# EAGLE design LED (EAGLE 9.6.2)
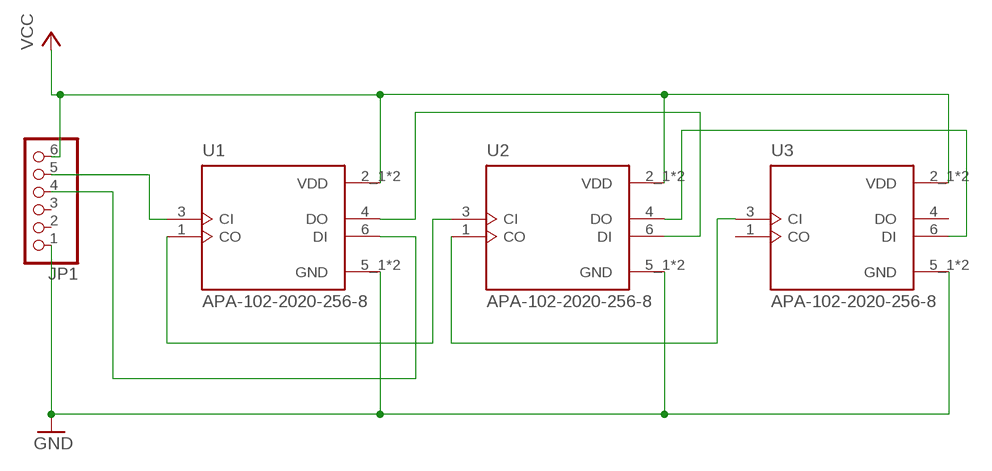
[diagram p0: schematic, sheet 1]

## Parts
JP1  PINHD-1X6CLEAN  [1X06-CLEAN]
U1  APA-102-2020-256-8  [LED_APA-102-2020-256-8]
U2  APA-102-2020-256-8  [LED_APA-102-2020-256-8]
U3  APA-102-2020-256-8  [LED_APA-102-2020-256-8]

## Nets
GND: JP1.1 U1.5_1(GND) U1.5_2(GND) U2.5_1(GND) U2.5_2(GND) U3.5_1(GND) U3.5_2(GND)
N$1: JP1.5 U1.3(CI)
N$2: JP1.4 U1.6(DI)
N$3: U1.1(CO) U2.3(CI)
N$4: U1.4(DO) U2.6(DI)
N$5: U2.4(DO) U3.6(DI)
N$6: U2.1(CO) U3.3(CI)
VCC: JP1.6 U1.2_1(VDD) U1.2_2(VDD) U2.2_1(VDD) U2.2_2(VDD) U3.2_1(VDD) U3.2_2(VDD)
Unconnected: JP1.2 JP1.3 U3.1(CO) U3.4(DO)

## Library data of the parts
JP1 = adafruit:PINHD-1X6: PIN HEADER
U1-U3 = APA-102-2020-256-8:APA-102-2020-256-8: 8-pin type LED three-color RGB Dimming control Check availability <https://pricing.snapeda.com/parts/APA-102-2020-256-8/iPixel%20LED%20Light%20Co./view-part?ref=eda>; AVAILABILITY: Not in stock; DESCRIPTION: 8-pin type LED three-color RGB Dimming control; MF: iPixel LED Light Co.; MP: APA-102-2020-256-8; PACKAGE: SMD-8 iPixel LED Light Co.; PRICE: None

## Board
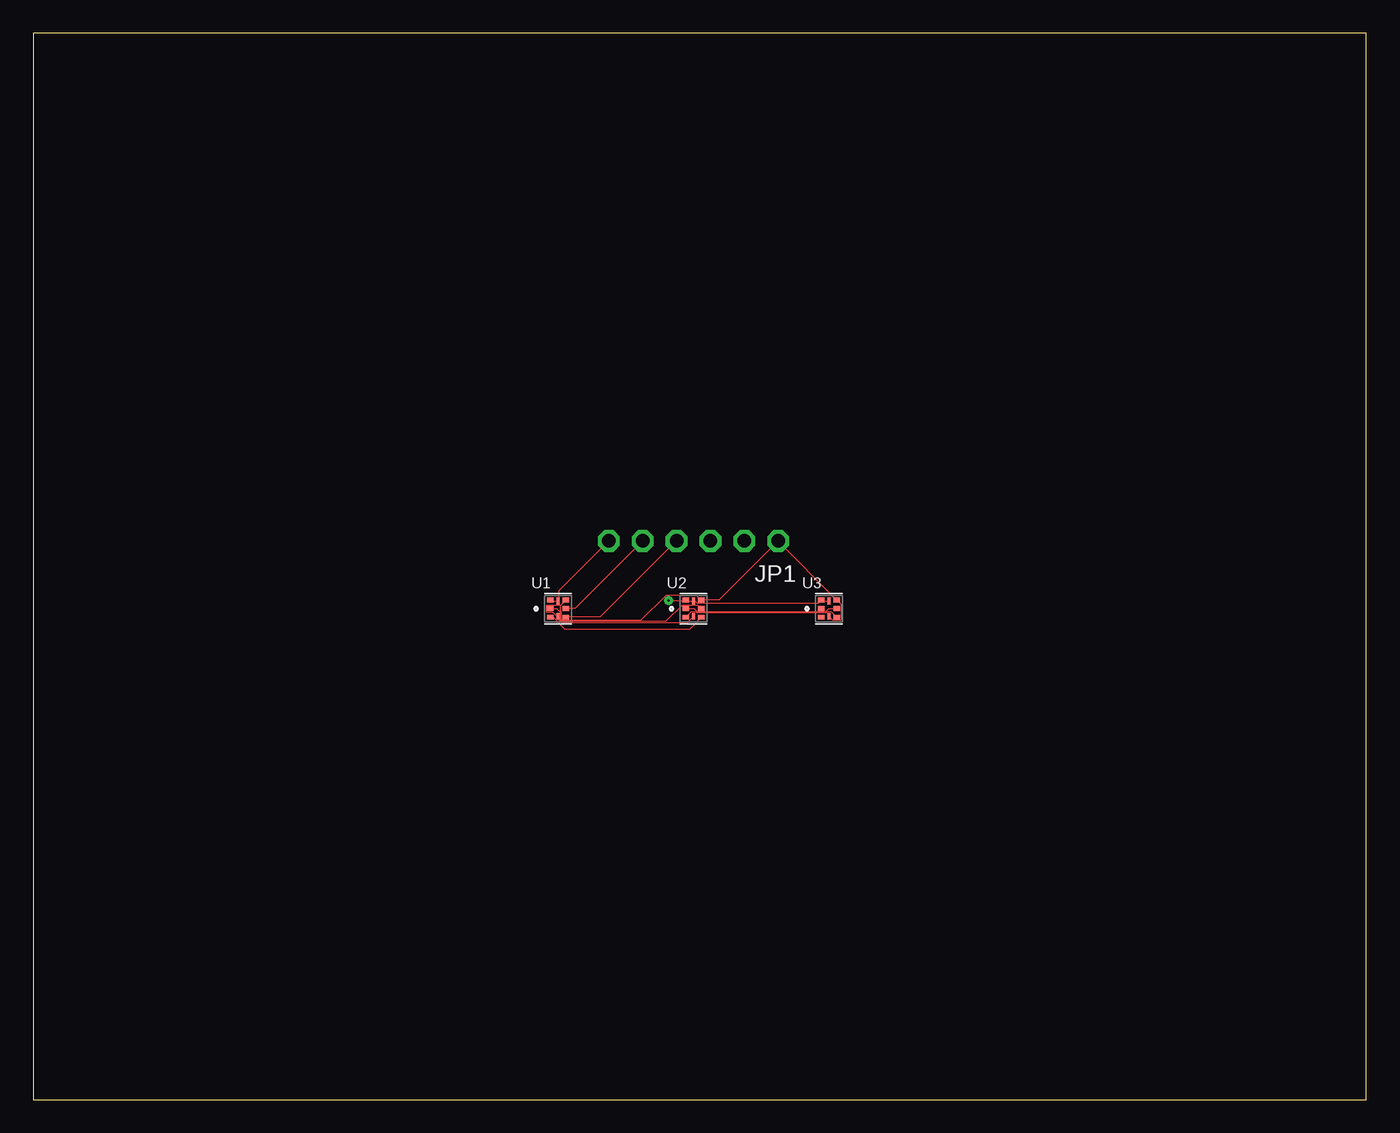
[diagram p1: board, top side]
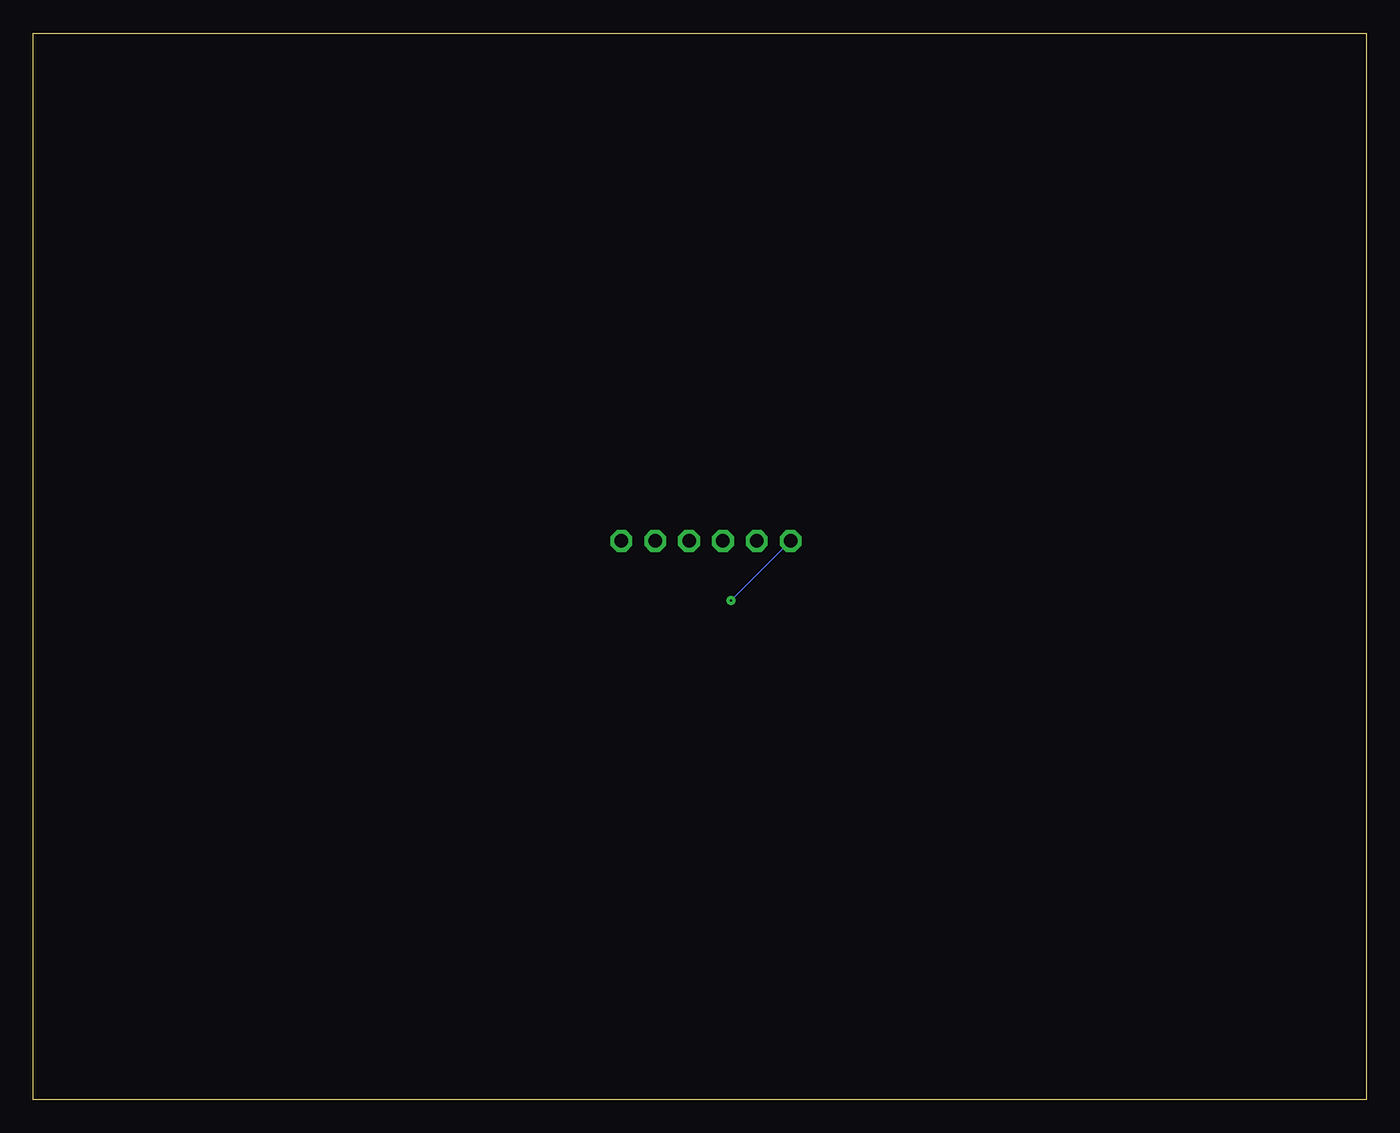
[diagram p2: board, bottom side, seen from below]

Size 100 x 80 mm. Coordinates in mm from the lower left corner, seen from the top.
Outline: 0,0 100,0 100,80 0,80 0,0
Copper layers (1*16): Top 0.035mm / dielectric 1.5mm / Bottom 0.035mm
Design rules "the-hive_minimum": minimum track width 2mil, minimum drill 0.15mm, track to track 1mil, track to pad 1mil, pad to pad 1mil, via to via 1mil, smd to smd 1mil, copper to edge 40mil, drill to drill 6mil, minimum pad ring 12mil, minimum via ring 10mil, stop-mask expansion 4mil, vias tented up to drill 25mil, thermal gap 10mil

### Footprints (pad centres in the part's own frame; a part is rotated, then mirrored left to right if it is on the bottom)
1X06-CLEAN = drill 1.016 octagon: 1 -6.35,0; 2 -3.81,0; 3 -1.27,0; 4 1.27,0; 5 3.81,0; 6 6.35,0
LED_APA-102-2020-256-8 = smd 0.5 x 0.37: 1 -0.585,0; 2_1 -0.585,0.64; 3 0.585,0; 4 -0.585,-0.64; 5_2 0.585,0.64; 6 0.585,-0.64 | smd 0.25 x 0.5: 2_2 0,0.575; 5_1 0,-0.575

### Placement (x,y rotation side)
JP1  49.53,41.91 180 top
U1  39.37,36.83 0 top
U2  49.53,36.83 0 top
U3  59.69,36.83 0 top

### Tracks (layer width: path | path; a pad name or v marks a point on that pad's centre or on a via)
GND
  Top 0.051: 39.55,37.07 38.52,37.07 38.48,37.03 38.48,36.61 38.52,36.58 38.94,36.58 39.24,36.27 39.36,36.27 U1.5_1 39.4,36.23 39.4,36.01 39.62,35.78 49.07,35.78 49.53,36.23 U2.5_1 | 39.55,37.07 39.93,37.45 U1.5_2 | U3.5_1 59.7,36.23 60.01,35.93 60.54,35.93 60.58,35.97 60.58,37.19 60.31,37.45 U3.5_2 60.27,37.49 55.85,41.91 | 55.85,41.91 51.44,37.49 50.14,37.49 U2.5_2 50.1,37.49 49.76,37.83 47.47,37.83 45.57,35.93 39.7,35.93 39.62,36.01 39.62,36.58 39.55,36.65 39.55,37.07 | 55.85,41.91 JP1.1
N$1
  Top 0.051: JP1.5 40.65,36.84 39.97,36.84 U1.3
N$2
  Top 0.051: U1.6 39.97,36.2 42.52,36.2 48.23,41.91 JP1.4
N$3
  Top 0.051: U1.1 38.79,36.8 39.28,36.8 39.55,36.54 39.55,35.97 39.66,35.85 47.43,35.85 48.65,37.07 49.87,37.07 50.1,36.84 U2.3
N$4
  Top 0.051: U1.4 38.79,36.16 39.01,36.16 39.89,35.28 49.23,35.28 50.1,36.16 U2.6
N$5
  Top 0.051: U2.4 49.34,36.58 49.72,36.58 49.8,36.5 59.47,36.5 59.55,36.58 59.89,36.58 U3.6
N$6
  Top 0.051: U2.1 48.96,36.8 49.61,36.8 49.84,36.58 59.44,36.58 59.66,36.8 60.27,36.8 U3.3
VCC  (via drill 0.15)
  Top 0.051: U3.2_2 59.66,37.41 59.17,37.41 59.13,37.45 U3.2_1 59.09,37.45 58.86,37.22 49.84,37.22 49.68,37.38 49.53,37.38 U2.2_2 49,37.41 48.96,37.45 U2.2_1 48.92,37.45 v47.66,37.45 | U1.2_1 38.79,37.45 38.82,37.41 39.36,37.41 U1.2_2 39.4,37.41 39.4,38.14 43.17,41.91 JP1.6
  Bottom 0.051: v47.66,37.45 43.2,41.91 JP1.6